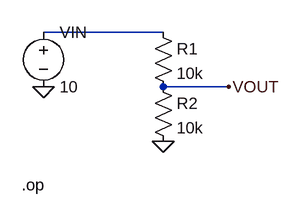
[diagram p0: schematic diviseur_resistif_fixe.asc]
diviseur_resistif_fixe.asc, the LTspice schematic file:
Version 4
SHEET 1 880 680
WIRE 80 96 256 96
WIRE 256 176 352 176
FLAG 80 176 0
FLAG 256 256 0
FLAG 352 176 VOUT
SYMBOL voltage 80 80 R0
WINDOW 123 0 0 Left 0
WINDOW 39 0 0 Left 0
SYMATTR InstName VIN
SYMATTR Value 10
SYMBOL res 240 80 R0
SYMATTR InstName R1
SYMATTR Value 10k
SYMBOL res 240 160 R0
SYMATTR InstName R2
SYMATTR Value 10k
TEXT 48 320 Left 2 !.op

The netlist it stands for:
* diviseur_resistif_fixe.asc
VIN N001 0 10
R1 N001 VOUT 10k
R2 VOUT 0 10k
.op
.backanno
.end